# Altium schematic sheet 01_POWER SUPPLY.SchDoc: SOMA Project
size A4; Revision: V1.0; SheetNumber: 1
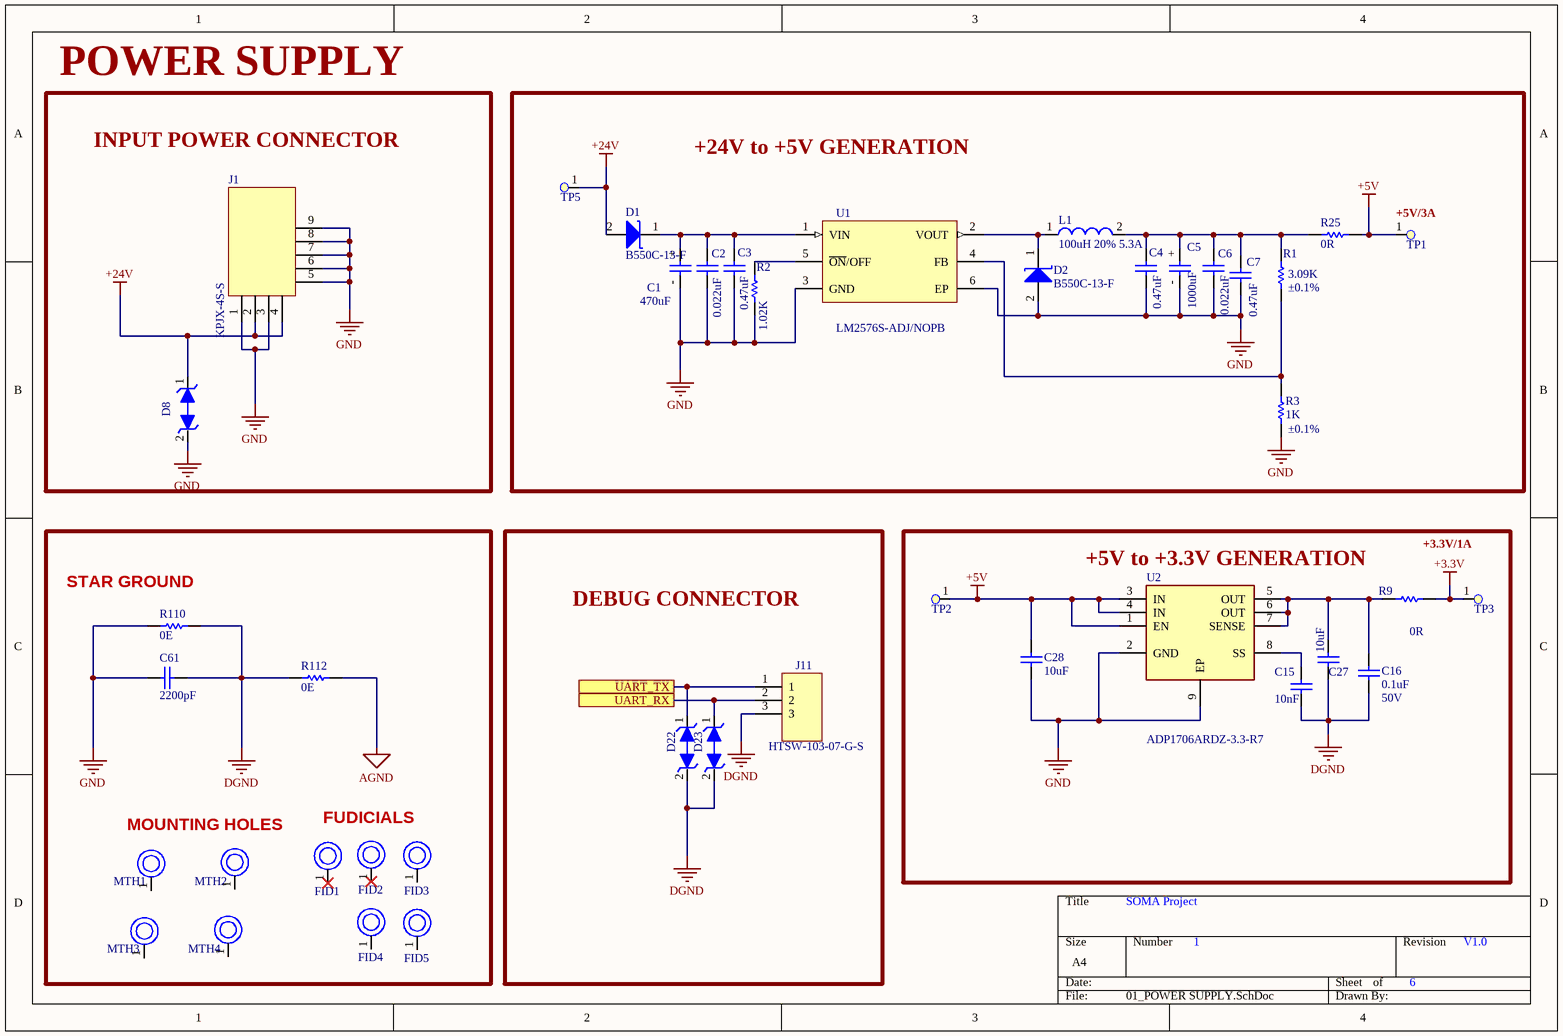
[diagram p0: 01_POWER SUPPLY.SchDoc]

## Parts
C1  value 470uF  [CAPAE1700X1650N]  (hidden comment: CAP ALUM 470UF 20% 63V SMD)
C2  value 0.022uF  [C0603]  (hidden comment: CAP CER 0.022UF 100V X7R 0603)
C3  value 0.47uF  [C1206]  (hidden comment: CAP CER 0.47UF 100V X7R 1206)
C4  value 0.47uF  [C1206]  (hidden comment: CAP CER 0.47UF 100V X7R 1206)
C5  value 1000uF  [CAPAE1300X1350N]  (hidden comment: CAP ALUM 1000UF 20% 25V SMD)
C6  value 0.022uF  [C0603]  (hidden comment: CAP CER 0.022UF 100V X7R 0603)
C7  value 0.47uF  [C1206]  (hidden comment: CAP CER 0.47UF 100V X7R 1206)
C15  value 10nF  [C0603]  (hidden comment: CAP CER 0603 10NF 25VDC X8G)
C16  Rating: 50V  [C0402]  (hidden comment: 0.1uF)
C27  value 10uF  [C0603]  (hidden comment: CAP CER 10UF 25V X5R 0603)
C28  value 10uF  [C0603]  (hidden comment: CAP CER 10UF 25V X5R 0603)
C61  value 2200pF  [C1206]  (hidden comment: CAP CER 2200PF 1.5KV X7R 1206)
D1  DIODE SCHOTTKY 50V 5A SMC  [SOD8060X250N_2A]  (value not drawn)
D2  DIODE SCHOTTKY 50V 5A SMC  [SOD8060X250N_2A]  (value not drawn)
D8  TVS DIODE 24VWM 38.9VC SMC  [SOD8060X260N_BI]  (value not drawn)
D22  TVS DIODE 3.3VWM 11.5VC SOD923  [SOD1006X40N_BI]  (value not drawn)
D23  TVS DIODE 3.3VWM 11.5VC SOD923  [SOD1006X40N_BI]  (value not drawn)
FID1  M3  [FIDUCIAL_40C]  (value not drawn)
FID2  M3  [FIDUCIAL_40C]  (value not drawn)
FID3  M3  [FIDUCIAL_40C]  (value not drawn)
FID4  M3  [FIDUCIAL_40C]  (value not drawn)
FID5  M3  [FIDUCIAL_40C]  (value not drawn)
J1  value KPJX-4S-S  [KYCON_KPJX-4S -S]  (hidden comment: CONN JACK FMALE 4POS TIN SOLDER)
J11  value HTSW-103-07-G-S  [BERG_1X3]  (hidden comment: CONN HEADER VERT 3POS 2.54MM)
L1  value 100uH 20% 5.3A  [IND_MGV1707101M-10]  (hidden comment: FIXED IND 100UH 5.3A 118MOHM SMD)
MTH1  M3  [MH]  (value not drawn)
MTH2  M3  [MH]  (value not drawn)
MTH3  M3  [MH]  (value not drawn)
MTH4  M3  [MH]  (value not drawn)
R1  value 3.09K  Tolerance: ±0.1%  [R1206]  (hidden comment: RES SMD 3.09K OHM 0.1% 1/4W 1206)
R2  value 1.02K  [R1206]  (hidden comment: RES SMD 1.02K OHM 1% 1/4W 1206)
R3  value 1K  Tolerance: ±0.1%  [R0805]  (hidden comment: RES 1K OHM 0.1% 1/8W 0805)
R9  value 0R  [R1206]  (hidden comment: RES 0 OHM JUMPER 1/4W 1206)
R25  value 0R  [R1206]  (hidden comment: RES 0 OHM JUMPER 1/4W 1206)
R110  0E  [R0603]
R112  0E  [R0603]
TP1  Test Point,1.6mm Diameter,SMD  [TP_63C]  (value not drawn)  (no BOM)
TP2  Test Point,1.6mm Diameter,SMD  [TP_63C]  (value not drawn)  (no BOM)
TP3  Test Point,1.6mm Diameter,SMD  [TP_63C]  (value not drawn)  (no BOM)
TP5  Test Point,1.6mm Diameter,SMD  [TP_63C]  (value not drawn)  (no BOM)
U1  value LM2576S-ADJ/NOPB  [TO-263-6_LM2576S]  (hidden comment: IC REG BUCK ADJ 3A TO263-5)
U2  Manufacturer part Number: ADP1706ARDZ-3.3-R7  [SOIC127P600X170-9N]  (hidden comment: IC REG LINEAR 3.3V 1A 8SOIC)

## Blocks framed on the sheet
POWER SUPPLY: D8 J1
+24V to +5V GENERATION: C1-C7 D1 D2 L1 R1-R3 R25 TP1 TP5 U1
DEBUG CONNECTOR: D22 D23 J11
+5V to +3.3V GENERATION: C15 C16 C27 C28 R9 TP2 TP3 U2

## Ports
UART_RX, UART_TX

## Nets
+3.3V: R9.2 TP3.1
+5V: C28.2 R25.2 TP1.1 TP2.1 U2.1(EN) U2.3(IN) U2.4(IN)
+24V: D1.2(A) D8.1(K) J1.2 J1.4 TP5.1
AGND: R112.2
DGND: C15.1 C16.1 C27.1 C61.2 D22.2(A) D23.2(A) J11.3 R110.2 R112.1
GND: C1.- C2.2 C3.1 C4.1 C5.- C6.1 C7.2 C28.1 C61.1 D2.2(A) D8.2(A) J1.1 J1.3 J1.5 J1.6 J1.7 J1.8 J1.9 R2.1 R3.1 R110.1 U1.3(GND) U1.6(EP) U2.2(GND) U2.9(EP)
UART_RX: D23.1(K) J11.2 ; port UART_RX
UART_TX: D22.1(K) J11.1 ; port UART_TX
NetC1_+: C1.+ C2.1 C3.2 D1.1(K) U1.1(VIN)
NetC4_2: C4.2 C5.+ C6.2 C7.1 L1.2 R1.2 R25.1
NetC15_2: C15.2 U2.8(SS)
NetC16_2: C16.2 C27.2 R9.1 U2.5(OUT) U2.6(OUT) U2.7(SENSE)
NetD2_1: D2.1(K) L1.1 U1.2(VOUT)
NetR1_1: R1.1 R3.2 U1.4(FB)
NetR2_2: R2.2 U1.5(~{ON}/OFF)

Not connected (* = marked no-connect by the designer): FID1 1*; FID2 1*; FID3 1; FID4 1; FID5 1; MTH1 1; MTH2 1; MTH3 1; MTH4 1

## Notes on the sheet
- INPUT POWER CONNECTOR
- (near TP1) +5V/3A
- +3.3V/1A
- (near R110) STAR GROUND
- MOUNTING HOLES
- FUDICIALS
- SOMA Project
- 1
- 6
- V1.0

## Library data of the parts
C1 = 470uF: Manufacturer: Panasonic Electronic Components; Manufacturer part Number: EEV-TG1J471M; Operating Temperature: -40°C ~ 125°C; Type: CAP; Package: Radial, Can - SMD; Reference link: https://www.digikey.com/en/products/detail/panasonic-electronic-components/EEV-TG1J471M/615967; Distributor: Digikey; Distributor part Number: PCE3667CT-ND; Unit Price: $2.49000; Tolerance: ±20%; Rating: 63V; Part Status: Active; Size / Dimension: 0.630" Dia (16.00mm)
C2 C6 = CAP CER 0.022UF 100V X7R 0603: Manufacturer: TDK Corporation; Manufacturer part Number: C1608X7R2A223K080AA; Tolerance: ±10%; Operating Temperature: -55°C ~ 125°C; Type: CAP; Package: 0603 (1608 Metric); Reference link: https://www.digikey.com/en/products/detail/tdk-corporation/C1608X7R2A223K080AA/789669; Distributor: Digikey; Distributor part Number: 445-2275-2-ND; Rating: 100V; Part Status: Active; Unit Price: $0.10000
C3 C4 C7 = CAP CER 0.47UF 100V X7R 1206: Manufacturer: TDK Corporation; Manufacturer part Number: C3216X7R2A474K160AE; Tolerance: ±10%; Operating Temperature: -55°C ~ 125°C; Type: CAP; Package: 1206 (3216 Metric); Reference link: https://www.digikey.com/en/products/detail/tdk-corporation/C3216X7R2A474K160AE/3283646; Distributor: Digikey; Distributor part Number: 445-8902-1-ND; Unit Price: $0.73000; Rating: 100V; Part Status: Active
C5 = CAP ALUM 1000UF 20% 25V SMD: Manufacturer: United Chemi-Con; Manufacturer part Number: EMVA250ARA102MKE0S; Prt Status: Active; Operating Temperature: -55°C ~ 105°C; Type: CAP; Package: 512" L x 0.512" W (13.00mm x 13.00mm); Reference link: https://www.digikey.be/product-detail/en/united-chemi-con/EMVA250ARA102MKE0S/565-2110-2-ND/756757; Distributor: Digikey; Distributor part Number: 565-2110-2-ND; Unit Price: 1.25$; Tolerance: 20%; Rating: 1000UF 20% 25V
C15 = CAP CER 0603 10NF 25VDC X8G: Manufacturer: KEMET; Manufacturer part Number: C0603C103K3TACAUTO; Tolerance: ±10%; Rating: 25V; Distributor: Digikey; Package: 0603 (1608 Metric); Type: CAP; Operating Temperature: -55°C ~ 150°C; Distributor part Number: C0603C103K3TACAUTO; Reference link: https://www.digikey.com/en/products/detail/kemet/C0603C103K3TACAUTO/13546784?s=N4IgjCBcpgLFoDGUBmBDANgZwKYBoQB7KAbXAFYBOAJlgHYQBdAgBwBcoQBlNgJwEsAdgHMQAXwJgAbAhDJI6bPiKkQAZhqwZzEO048BI8QSmVZ8xbgLFIZWAAZKsaU1YdI3PkNETwlABxm0HKomFYqtiD2rrrunoY%2BBNT2sEFIoUrWqmD2AASCAGIxeh4AqoL8bADyKACyOGhYAK68OMYgALTU5lB8Tco2ZORMvh1qPZB9A9nRjGK%2B3ZE5hSNAA; Unit Price: $0.45000
C16 = CAP CER 0.1UF 50V X7R 0402: Manufacturer: AVX; Manufacturer part Number: 04025C104KAT2A; Tolerance: ±10%; Operating Temperature: -55°C ~ 125°C; Value: 0.1uF; Package: 0402; Distributor: Mouser; Reference link: https://www.mouser.in/ProductDetail/AVX/04025C104KAT2A?qs=%2Fha2pyFaduhvAwOoQhW9hDDlPxePcbvdgYQJEdBTMGpxgpoTOSNvPA%3D%3D; Distributor part Number: 581-04025C104KAT2A; Type: CAP; Unit Price: ₹7.47
C27 C28 = CAP CER 10UF 25V X5R 0603: Manufacturer: Murata Electronics; Manufacturer part Number: ZRB18AR61E106ME01L; Tolerance: ±20%; Distributor: Digikey; Package: 0603 (1608 Metric); Type: CAP; Operating Temperature: -55°C ~ 85°C; Distributor part Number: 490-10991-1-ND; Reference link: https://www.digikey.com/en/products/detail/murata-electronics/ZRB18AR61E106ME01L/5321083; Unit Price: $0.50000; Rating: 25V
C61 = CAP CER 2200PF 1.5KV X7R 1206: Manufacturer: AVX Corporation; Manufacturer part Number: 1206SC222KAT2A; Tolerance: ±10%; Rating: 1500V; Operating Temperature: -55°C ~ 125°C; Type: CAP; Package: 1206 (3216 Metric); Reference link: https://www.digikey.com/en/products/detail/avx-corporation/1206SC222KAT2A/7536088; Distributor: Digikey; Distributor part Number: 478-10699-1-ND - Cut Tape (CT); Part Status: Active; Unit Price: $0.78000
D1 D2 = B550C-13-F: Manufacturer: Diodes Incorporated; Value: 50V/5A SCHOTTKY; Rating: 50V,5A; Operating Temperature: -55°C ~ 150°C; Package: DO-214AB, SMC; Distributor: Digi-key; Type: Diode; Manufacturer part Number: B550C-13-F; Reference link: https://www.digikey.com/en/products/detail/diodes-incorporated/B550C-13-F/768772?s=N4IgTCBcDaIEIFYEAYDCBaAjAZnQMQAIQBdAXyA; Distributor part Number: B550C-FDICT-ND; Unit Price: $0.58000; Part Status: Active
D8 = TVS DIODE 24VWM 38.9VC SMC: 38.9V Clamp 77.2A Ipp Tvs Diode Surface Mount DO-214AB (SMC); Manufacturer: Bourns Inc.; Manufacturer part Number: SMLJ24CA-Q; Rating: 3000W (3kW); Tolerance: NA; Operating Temperature: -55°C ~ 150°C (TJ); Value: 38.9V Clamp 77.2A; Package: DO-214AB, SMC; Distributor: Digikey; Type: TVS; Reference link: https://www.digikey.com/en/products/detail/bourns-inc/SMLJ24CA-Q/8275811; Distributor part Number: SMLJ24CA-QCT-ND; Unit Price: $1.45000
D22 D23 = TVS DIODE 3.3VWM 11.5VC SOD923: 11.5V Clamp 2A (8/20µs) Ipp Tvs Diode Surface Mount SOD-923; Manufacturer Part Number: ESD9B3.3ST5G; Manufacturer: ON Semiconductor; Value: 3.3V 11.5V; Assembly Option: DNP; Tolerance: NA; Operating Temperature: -55°C to +150°C; Distributor: Digikey; Distributor part Number: ESD9B3.3ST5GOSTR-ND; Package: SOD-923; Rating: 3.3V 11.5V; Reference link: https://www.digikey.com/product-detail/en/on-semiconductor/ESD9B3.3ST5G/ESD9B3.3ST5GOSTR-ND/1973669; Type: TVS; Unit Price: $0.24000
FID1-FID5 MTH1-MTH4 = Fiducial: Part Category: Screw; Discription: MACHINE SCREW PAN  M3; Loading: P; Internal Part no: *; Value: M3; MFR: *; Vendor id: *; MFR Part no: *; Vendor: *; Operating temp: *; ROHS: *
J1 = CONN JACK FMALE 4POS TIN SOLDER: 4 (Power) Position Circular Connector Jack, Female Sockets Solder; Manufacturer: Kycon, Inc.; Rating: 7.5A, 48VDC, UL94 V-0; Manufacturer Part Number: KPJX-4S-S; Package: Tray; Part Status: Active; Connector Type: Jack, Female Sockets; Mounting Type: Through Hole, Right Angle; Operating Temperature: -40°C ~ 75°C; ComponentLink1Description: Datasheet; ComponentLink1URL: https://www.digikey.com/en/products/detail/kycon-inc/KPJX-4S-S/9990088; Distributor: Digikey; Distributor Part Number: 2092-KPJX-4S-S-ND; Type: Through Hole, Right Angle; Assembly Option: *; Unit Price: $2.41000; Tolerance: *; Reference Link: https://www.digikey.com/en/products/detail/kycon-inc/KPJX-4S-S/9990088?s=N4IgTCBcDaINIAUBSANAtAFgMpqyAugL5A
J11 = CONN HEADER VERT 3POS 2.54MM: Connector Header Through Hole 3 position 0.100" (2.54mm); Manufacturer: Samtec Inc.; Rating: UL94 V-0; Tolerance: NA; Unit Price: $0.55000; Distributor: Digikey; Distributor part Number: SAM8814-ND; Manufacturer part Number: HTSW-103-07-G-S; Package: Bag; Reference link: https://www.digikey.com/en/products/detail/samtec-inc/HTSW-103-07-G-S/2345285; Type: Header, Male Pin, Through hole
L1 = FIXED IND 100UH 5.3A 118MOHM SMD: Manufacturer: Laird-Signal Integrity Products; Manufacturer part Number: MGV1707101M-10; Tolerance: ±20%; Distributor: Digikey; Distributor part Number: 240-3213-1-ND; Reference link: https://www.digikey.com/en/products/detail/laird-signal-integrity-products/MGV1707101M-10/9558761; Package: Nonstandard; Operating Temperature: -55°C ~ 125°C; Type: IND; Unit Price: $5.72000; Size / Dimension: 0.693" L x 0.665" W (17.60mm x 16.90mm); Part Status: Active
R1 = RES SMD 3.09K OHM 0.1% 1/4W 1206: Manufacturer: Panasonic; Manufacturer part Number: ERA-8AEB3091V; Distributor: Digikey; Distributor part Number: P3.09KBCCT-ND; Unit Price: $0.57000; Reference link: https://www.digikey.com/en/products/detail/panasonic-electronic-components/ERA-8AEB3091V/3070954; Type: RES; Package: 1206 (3216 Metric); Part Status: Active; Operating Temperature: -55°C ~ 155°C; Size / Dimension: 0.122" L x 0.063" W (3.10mm x 1.60mm)
R2 = RES SMD 1.02K OHM 1% 1/4W 1206: Manufacturer: Vishay Dale; Manufacturer part Number: CRCW12061K02FKEA; Distributor: Digikey; Distributor part Number: 541-1.02KFCT-ND; Unit Price: $0.10000; Reference link: https://www.digikey.com/en/products/detail/vishay-dale/CRCW12061K02FKEA/1176645; Type: RES; Rating: AEC-Q200; Package: 1206 (3216 Metric); Tolerance: ±1%; Part Status: Active; Operating Temperature: -55°C ~ 155°C
R3 = RES 1K OHM 0.1% 1/8W 0805: Manufacturer: Panasonic; Manufacturer part Number: ERA-6AEB102V; Distributor: Digikey; Distributor part Number: P1.0KDACT-ND; Unit Price: $0.310000; Reference link: https://www.digikey.com/en/products/detail/panasonic-electronic-components/ERA-6AEB102V/1465748; Type: RES; Rating: 1/8W; Package: 0805 (2012 Metric); Part Status: Active; Operating Temperature: -55°C ~ 155°C; Size / Dimension: 0.039" L x 0.020" W (1.00mm x 0.50mm)
R9 R25 = RES 0 OHM JUMPER 1/4W 1206: Manufacturer: Yageo; Manufacturer part Number: RC1206JR-100RL; Distributor: Digikey; Distributor part Number: 13-RC1206JR-100RLTR-ND; Unit Price: 0.01063; Reference link: https://www.digikey.sg/product-detail/en/yageo/RC1206JR-100RL/13-RC1206JR-100RLTR-ND/13694179; Type: RES; Package: 1206 (3216 Metric); Tolerance: Jumper; Part Status: Active; Operating Temperature: -55°C ~ 155°C; Size / Dimension: 0.122" L x 0.063" W (3.10mm x 1.60mm)
R110 = RES SMD 0 OHM JUMPER 1/10W 0603: Manufacturer part Number: RC0603JR-070RL; Manufacturer: Yageo; Assembly Option: DNP; Operating Temperature: -55°C ~ 155°C; Value: 0E; Distributor: Digikey; Package: 0603; Type: RES; Distributor part Number: 311-0.0GRCT-ND; Reference link: https://www.digikey.com/product-detail/en/yageo/RC0603JR-070RL/311-0.0GRCT-ND/729622; Rating: 1/10W; Cost: 0.00412
R112 = RES SMD 0 OHM JUMPER 1/10W 0603: Manufacturer part Number: RC0603JR-070RL; Manufacturer: Yageo; Operating Temperature: -55°C ~ 155°C; Value: 0E; Distributor: Digikey; Package: 0603; Type: RES; Distributor part Number: 311-0.0GRCT-ND; Reference link: https://www.digikey.com/product-detail/en/yageo/RC0603JR-070RL/311-0.0GRCT-ND/729622; Rating: 1/10W; Cost: 0.00412
U1 = IC REG BUCK ADJ 3A TO263-5: Buck Switching Regulator IC Positive Adjustable 1.23V 1 Output 3A TO-263-6, D²Pak (5 Leads + Tab), TO-263BA; Manufacturer: Texas Instruments; Tolerance: NA; Manufacturer part Number: LM2576S-ADJ/NOPB; Distributor: Digikey; Distributor part Number: LM2576S-ADJ/NOPB-ND; Package: TO-263-6, D²Pak (5 Leads + Tab), TO-263BA; Rating: 1.23V 1 Output 3A; Type: IC; Operating Temperature: -40°C ~ 125°C (TJ); Unit Price: $4.79000; Reference link: https://www.digikey.com/en/products/detail/texas-instruments/LM2576S-ADJ-NOPB/363655
U2 = IC REG LINEAR 3.3V 1A 8SOIC: Linear Voltage Regulator IC Positive Fixed 1 Output 1A 8-SOIC-EP; Manufacturer: Analog Devices Inc.; Tolerance: NA; Value: ADP1706ARDZ-3.3-R7; Rating: 3.3V 1A; Package: 8-SOIC (0.154", 3.90mm Width) Exposed Pad; Operating Temperature: -40°C ~ 125°C; Distributor: Digikey; Distributor part Number: ADP1706ARDZ-3.3-R7CT-ND; Reference link: https://www.digikey.com/en/products/detail/analog-devices-inc/ADP1706ARDZ-3-3-R7/1766873?s=N4IgTCBcDaIIIBEAKBGA7ABgGxwEoIC0BaAZgDoSjc0QBdAXyA; Type: IC; Unit Price: $3.15000
TP1-TP3 TP5 = Test Point,1.6mm Diameter,SMD: AEMCI Part Number: *; Vendor: *; Vendor ID: *